# EAGLE design audio (EAGLE 6.4)
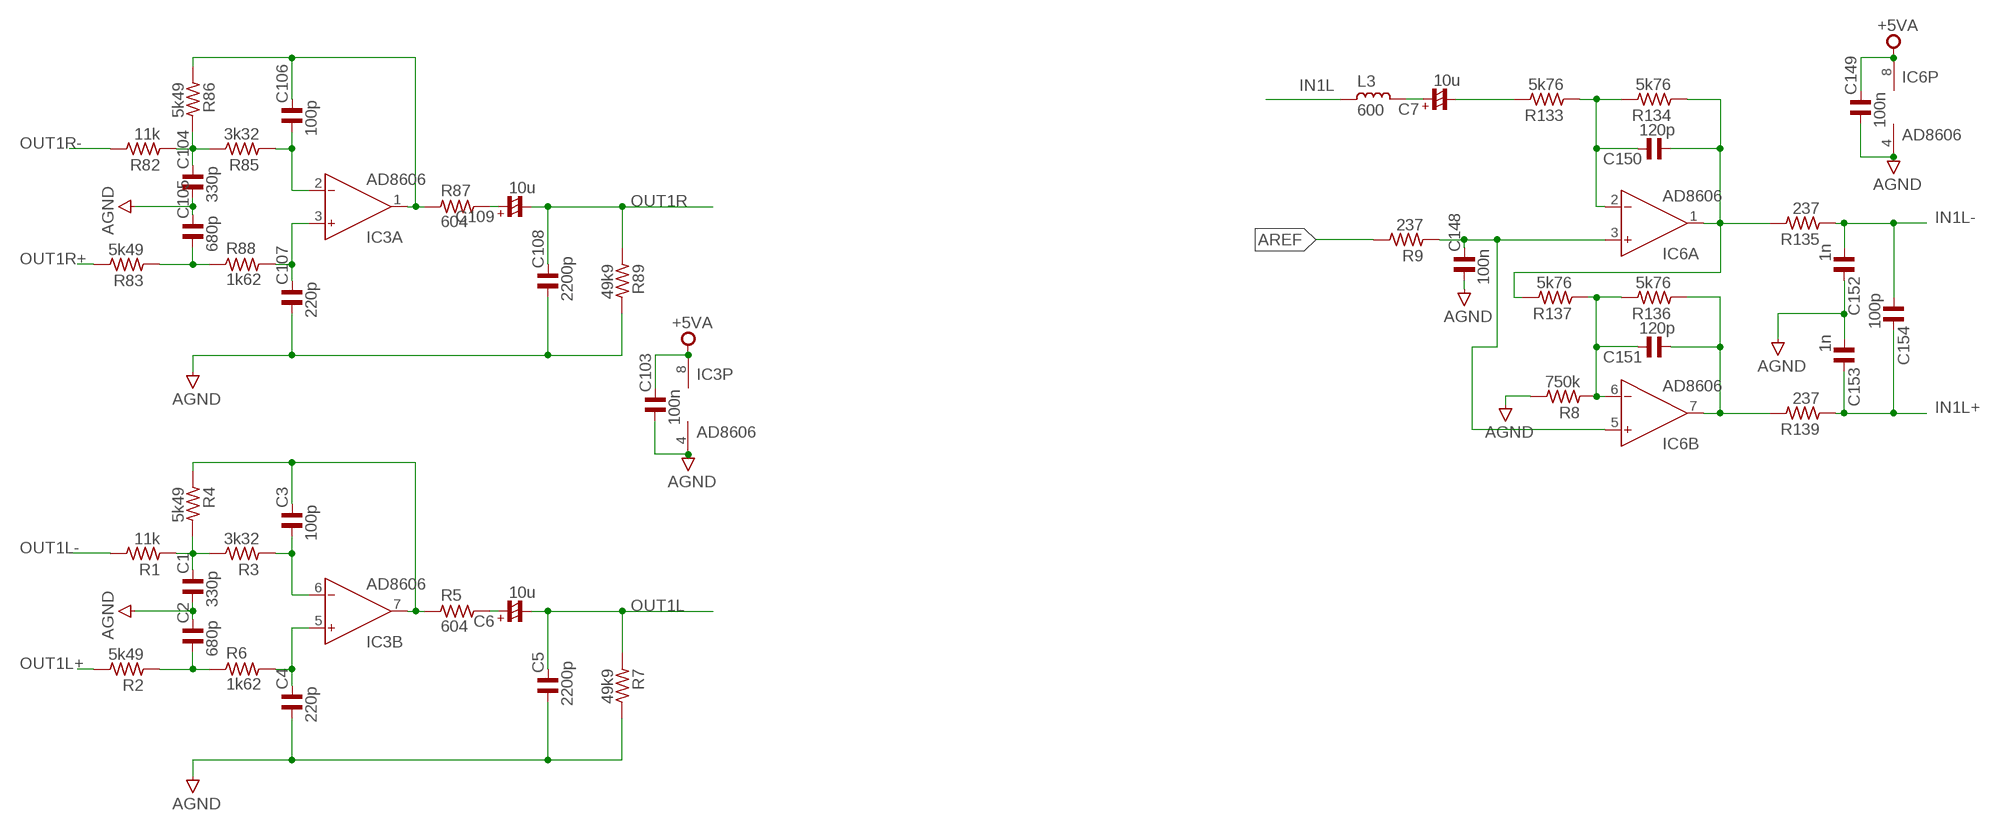
[diagram p0: schematic, sheet 1]

## Parts
C1  330p  C_0603  [C0603]
C2  680p  C_0603  [C0603]
C3  100p  C_0603  [C0603]
C4  220p  C_0603  [C0603]
C5  2200p  C_0603  [C0603]
C6  10u  CP_1206/T  [C1206/T]
C7  10u  CP_1206/T  [C1206/T]
C103  100n  C_0603  [C0603]
C104  330p  C_0603  [C0603]
C105  680p  C_0603  [C0603]
C106  100p  C_0603  [C0603]
C107  220p  C_0603  [C0603]
C108  2200p  C_0603  [C0603]
C109  10u  CP_1206/T  [C1206/T]
C148  100n  C_0603  [C0603]
C149  100n  C_0603  [C0603]
C150  120p  C_0603  [C0603]
C151  120p  C_0603  [C0603]
C152  1n  C_0603  [C0603]
C153  1n  C_0603  [C0603]
C154  100p  C_0603  [C0603]
IC3  AD8606  AD8607R  [SO8]
IC6  AD8606  AD8607R  [SO8]
L3  600  L_1206  [L1206]
R1  11k  R_0603  [R0603]
R2  5k49  R_0603  [R0603]
R3  3k32  R_0603  [R0603]
R4  5k49  R_0603  [R0603]
R5  604  R_0603  [R0603]
R6  1k62  R_0603  [R0603]
R7  49k9  R_0603  [R0603]
R8  750k  R_0603  [R0603]
R9  237  R_0603  [R0603]
R82  11k  R_0603  [R0603]
R83  5k49  R_0603  [R0603]
R85  3k32  R_0603  [R0603]
R86  5k49  R_0603  [R0603]
R87  604  R_0603  [R0603]
R88  1k62  R_0603  [R0603]
R89  49k9  R_0603  [R0603]
R133  5k76  R_0603  [R0603]
R134  5k76  R_0603  [R0603]
R135  237  R_0603  [R0603]
R136  5k76  R_0603  [R0603]
R137  5k76  R_0603  [R0603]
R139  237  R_0603  [R0603]

## Nets
+5VA: C103.2 C149.2 IC3.8(P:V+) IC6.8(P:V+)
AGND: C1.1 C2.2 C4.1 C5.1 C103.1 C104.1 C105.2 C107.1 C108.1 C148.1 C149.1 C152.2 C153.1 IC3.4(P:V-) IC6.4(P:V-) R7.2 R8.2 R89.2
AREF: R9.2
IN1L: L3.2
IN1L+: C153.2 C154.2 R139.1
IN1L-: C152.1 C154.1 R135.1
N$1: C1.2 R1.1 R3.2 R4.2
N$2: C2.1 R2.1 R6.1
N$3: C4.2 IC3.5(B:IN+) R6.2
N$4: C3.2 IC3.7(B:OUT) R4.1 R5.1
N$5: C6.+ R5.2
N$6: C3.1 IC3.6(B:IN-) R3.1
N$7: C7.+ L3.1
N$8: C7.- R133.2
N$10: C148.2 IC6.3(A:IN+) IC6.5(B:IN+) R9.1
N$68: C104.2 R82.1 R85.2 R86.2
N$69: C105.1 R83.1 R88.1
N$70: C107.2 IC3.3(A:IN+) R88.2
N$71: C106.2 IC3.1(A:OUT) R86.1 R87.1
N$72: C109.+ R87.2
N$74: C106.1 IC3.2(A:IN-) R85.1
N$104: C150.1 IC6.1(A:OUT) R134.1 R135.2 R137.2
N$105: C151.1 IC6.7(B:OUT) R136.1 R139.2
N$108: C150.2 IC6.2(A:IN-) R133.1 R134.2
N$110: C151.2 IC6.6(B:IN-) R8.1 R136.2 R137.1
OUT1L: C5.2 C6.- R7.1
OUT1L+: R2.2
OUT1L-: R1.2
OUT1R: C108.2 C109.- R89.1
OUT1R+: R83.2
OUT1R-: R82.2

## Library data of the parts
C1-C5 C103-C108 C148-C154 = rc-master-smd:C_: NON-POLARIZED CAP
C6 C7 C109 = rc-master-smd:CP_: POLARIZED CAP
IC3 IC6 = analog-devices:AD8607: Precision Micropower, Low Noise CMOS, Rail-to-Rail Input/Output Operational Amplifiers Source: http://www.analog.com/static/imported-files/data_sheets/AD8603_8607_8609.pdf; MPN: AD8607ARMZ-R2; OC_FARNELL: 1651293; OC_NEWARK: 19M8927
L3 = rc-master-smd:L_: INDUCTOR
R1-R9 R82 R83 R85-R89 R133-R137 R139 = rc-master-smd:R_: RESISTOR

## Board
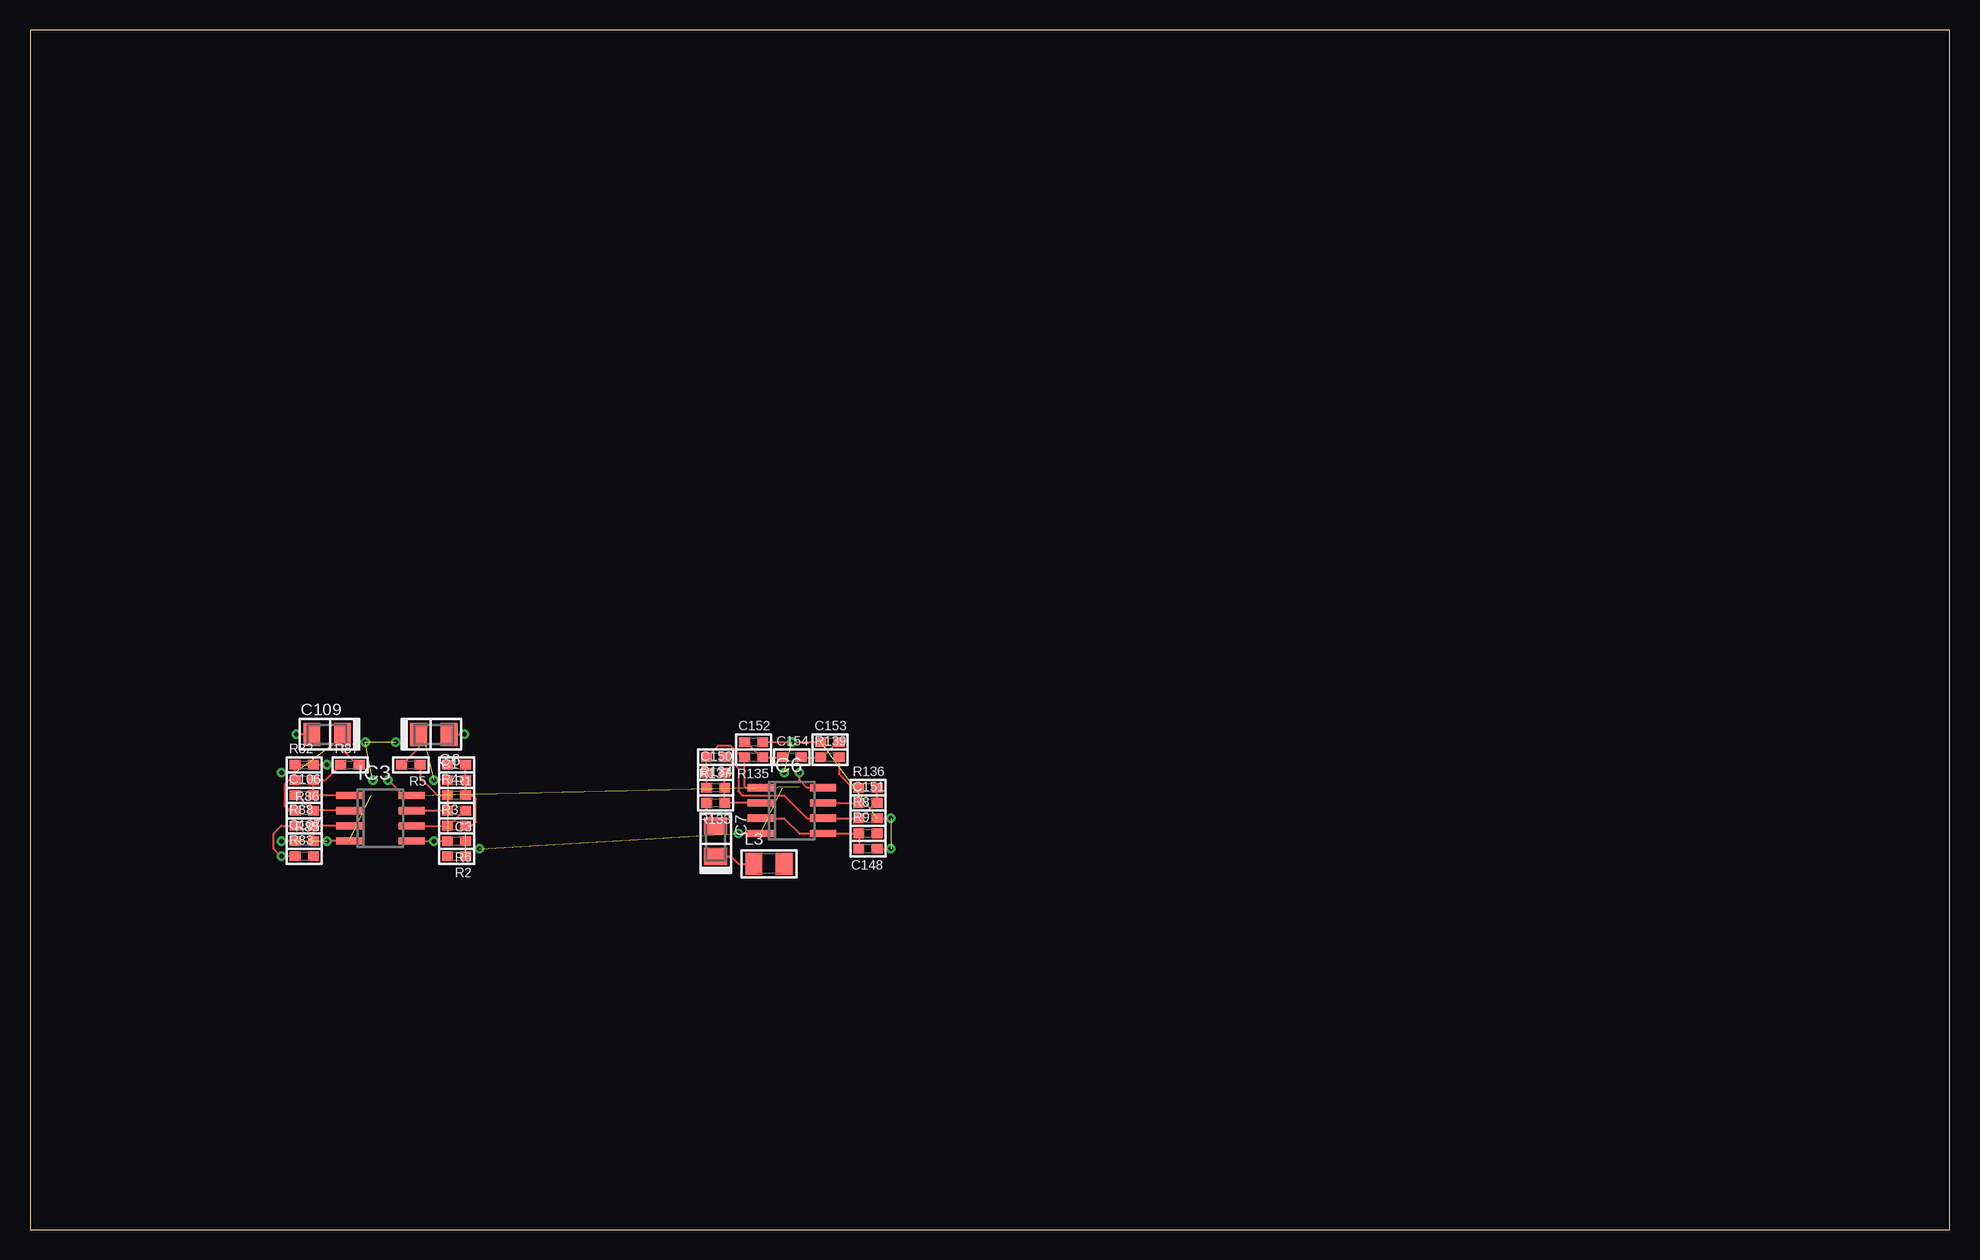
[diagram p1: board, top side]
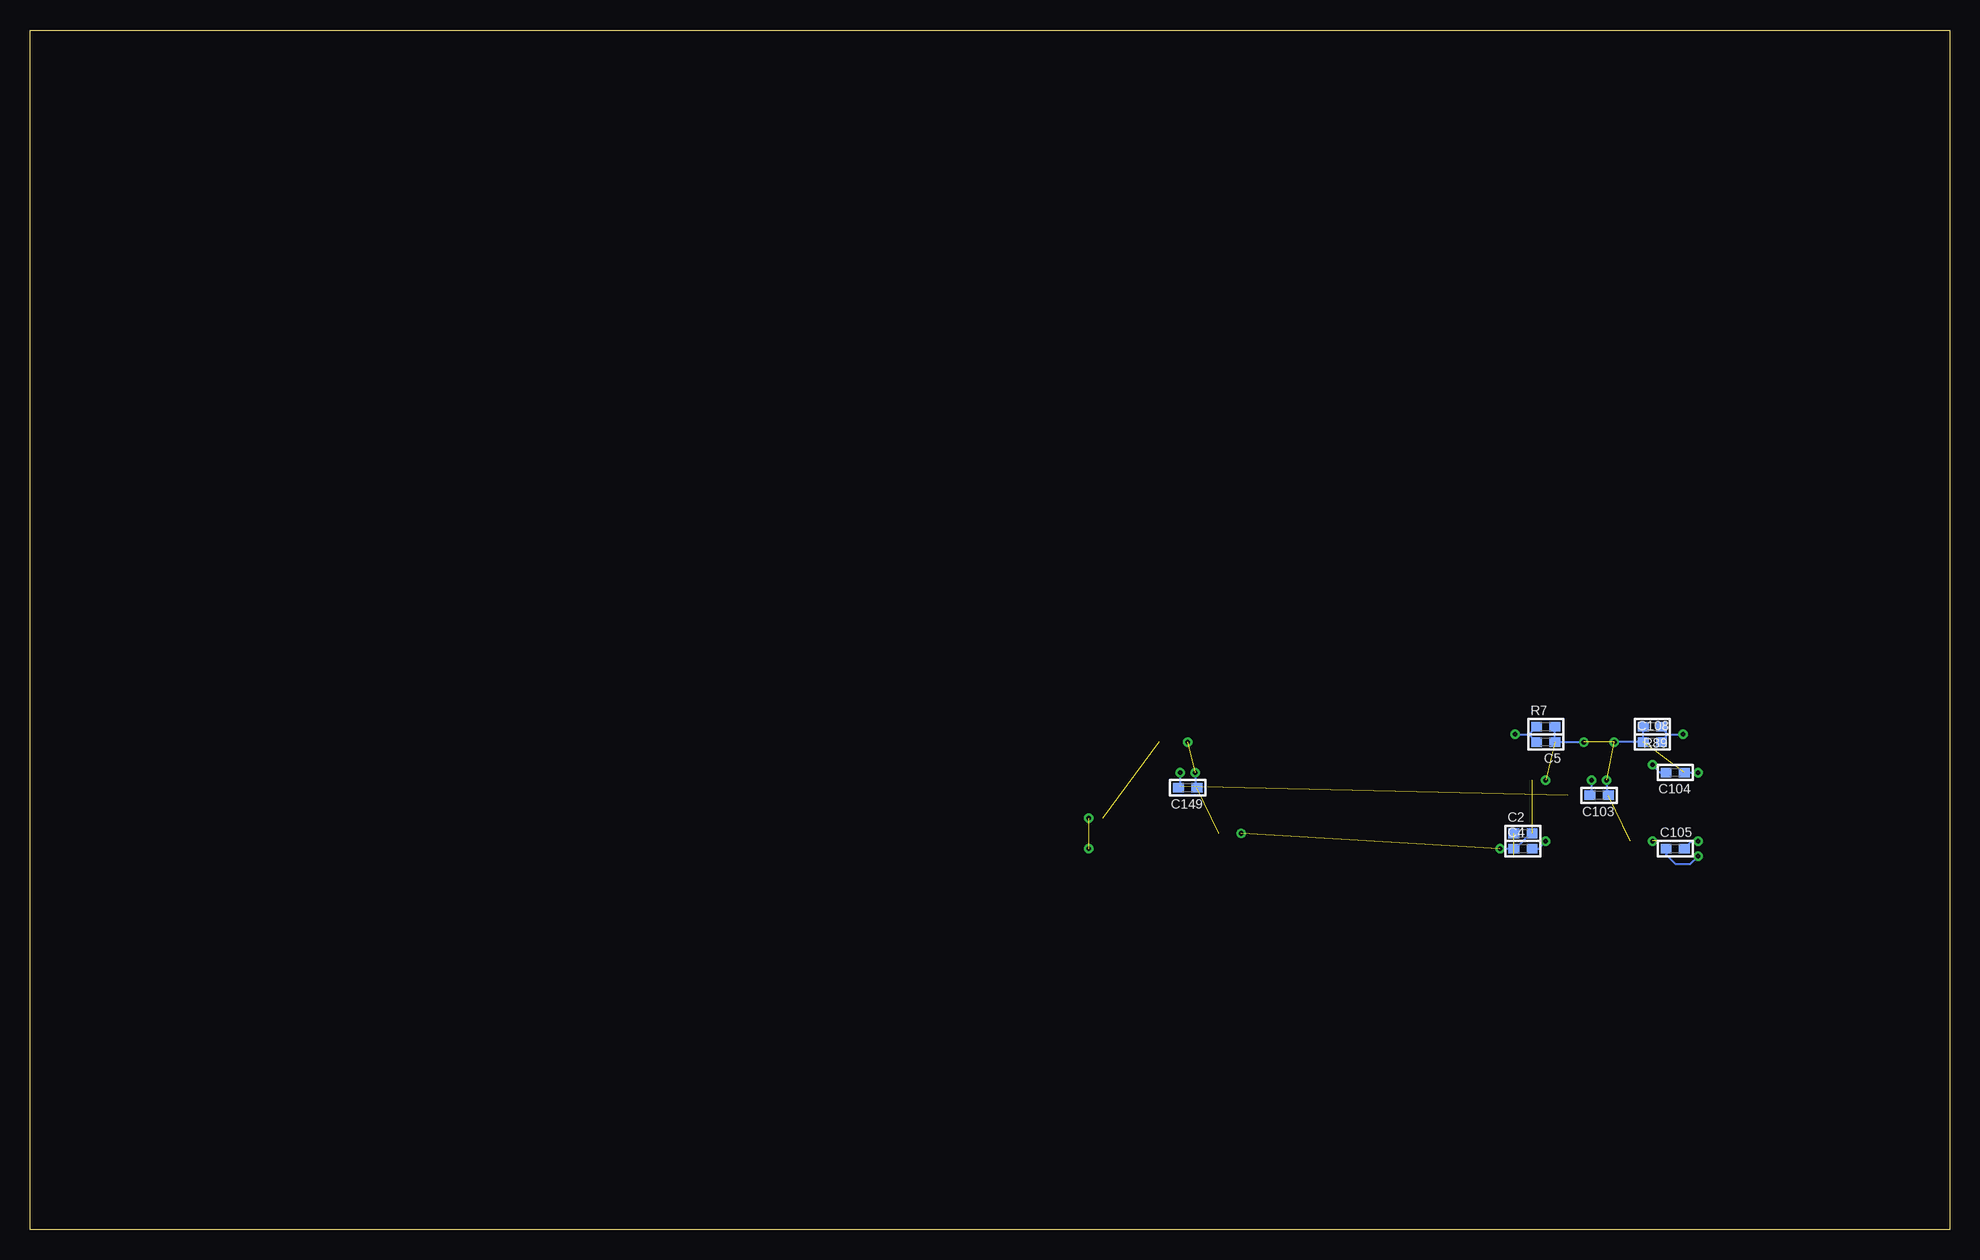
[diagram p2: board, bottom side, seen from below]

Size 160 x 100 mm. Coordinates in mm from the lower left corner, seen from the top.
Outline: 0,0 160,0 160,100 0,100 0,0
Copper layers (1*16): Top 0.035mm / dielectric 1.5mm / Bottom 0.035mm
Design rules "default": minimum track width 10mil, minimum drill 24mil, track to track 8mil, track to pad 8mil, pad to pad 8mil, via to via 8mil, smd to smd 8mil, copper to edge 40mil, drill to drill 8mil, minimum pad ring 10mil, minimum via ring 8mil, stop-mask expansion 4mil, vias tented up to drill 0mil, thermal gap 10mil

### Footprints (pad centres in the part's own frame; a part is rotated, then mirrored left to right if it is on the bottom)
C0603 = smd 0.9 x 0.8: 1 -0.762,0; 2 0.762,0
C1206/T = smd 1.4 x 1.9: + 1.27,0; - -1.27,0
SO8 = smd 0.6 x 2.2: 1 -1.905,-2.6; 2 -0.635,-2.6; 3 0.635,-2.6; 4 1.905,-2.6; 5 1.905,2.6; 6 0.635,2.6; 7 -0.635,2.6; 8 -1.905,2.6
L1206 = smd 1.4 x 1.8: 1 -1.27,0; 2 1.27,0
R0603 = smd 0.9 x 0.8: 1 -0.762,0; 2 0.762,0

### Placement (x,y rotation side)
C1  35.56,37.47 0 top
C2  35.56,33.02 0 bottom
C3  35.56,34.92 180 top
C4  35.56,31.75 0 bottom
C5  33.66,40.64 180 bottom
C6  33.66,41.27 180 top
C7  57.15,32.38 270 top
C103  29.21,36.2 180 bottom
C104  22.86,38.1 180 bottom
C105  22.86,31.75 0 bottom
C106  22.86,36.2 0 top
C107  22.86,32.38 0 top
C108  24.77,40.64 0 bottom
C109  24.77,41.27 0 top
C148  69.85,31.75 180 top
C149  63.5,36.83 180 bottom
C150  57.15,38.1 0 top
C151  69.85,35.56 0 top
C152  60.33,40.64 0 top
C153  66.67,40.64 0 top
C154  63.5,39.37 0 top
IC3  29.21,34.29 270 top
IC6  63.5,34.92 270 top
L3  61.59,30.48 0 top
R1  35.56,38.73 180 top
R2  35.56,31.11 180 top
R3  35.56,33.66 0 top
R4  35.56,36.2 0 top
R5  31.75,38.73 180 top
R6  35.56,32.38 180 top
R7  33.66,41.91 0 bottom
R8  69.85,34.29 0 top
R9  69.85,33.02 0 top
R82  22.86,38.73 0 top
R83  22.86,31.11 0 top
R85  22.86,34.92 180 top
R86  22.86,37.47 180 top
R87  26.67,38.73 0 top
R88  22.86,33.66 0 top
R89  24.77,41.91 180 bottom
R133  57.15,35.56 180 top
R134  57.15,36.83 0 top
R135  60.33,39.37 180 top
R136  69.85,36.83 0 top
R137  57.15,39.37 180 top
R139  66.67,39.37 0 top

### Tracks (layer width: path | path; a pad name or v marks a point on that pad's centre or on a via)
+5VA  (via drill 0.38)  (1 unrouted)
  Top 0.152: IC3.8 31.11,36.2 v29.84,37.47 | IC6.8 64.77,36.83 64.14,37.47 v64.14,38.1
  Bottom 0.152: v29.84,37.47 29.84,36.32 C103.2 | v64.14,38.1 64.14,36.96 C149.2
AGND  (via drill 0.38)  (12 unrouted)
  Top 0.152: IC3.4 v24.77,32.38 | C107.1 v20.95,32.38 | C1.1 v33.66,37.47 | IC6.4 v59.05,33.02 | C152.2 v63.5,40.64 C153.1 | C148.1 v71.75,31.75 | R8.2 v71.75,34.29
  Bottom 0.152: v20.95,32.38 21.46,32.38 C105.2 | C104.1 v20.95,38.1 | R89.2 C108.1 v27.94,40.64 | v28.57,37.47 28.57,36.32 C103.1 | R7.2 C5.1 v30.48,40.64 | C2.2 34.92,33.02 36.2,31.75 C4.1 v37.47,31.75 | v62.87,38.1 62.87,36.96 C149.1
IN1L+
  Top 0.152: C154.2 R139.1 66.04,39.37 67.31,40.64 C153.2
IN1L-
  Top 0.152: C154.1 R135.1 60.96,39.37 59.69,40.64 C152.1
N$1
  Top 0.152: R3.2 36.83,33.66 37.15,33.97 37.15,35.88 36.83,36.2 R4.2 C1.2 R1.1
N$2  (2 unrouted)
N$3  (via drill 0.38)
  Top 0.152: IC3.5 v33.66,32.38 R6.2
  Bottom 0.152: C4.2 34.29,31.75 v33.66,32.38
N$4
  Top 0.152: IC3.7 C3.2 R4.1 33.97,36.2 32.51,37.66 R5.1
N$5
  Top 0.152: C6.+ 32.38,40.13 R5.2
N$6
  Top 0.152: IC3.6 R3.1 34.92,33.66 36.2,34.92 C3.1
N$7
  Top 0.152: C7.+ 58.42,31.11 59.05,30.48 L3.1
N$8
  Top 0.152: R133.2 56.39,35.05 56.83,34.61 56.83,33.97 C7.-
N$10
  Top 0.152: IC6.3 62.87,34.29 64.14,33.02 IC6.5 R9.1 C148.2
N$68  (via drill 0.38)
  Top 0.152: R85.2 21.59,34.92 21.27,35.24 21.27,37.15 21.59,37.47 R86.2 R82.1 v24.77,38.73
  Bottom 0.152: C104.2 24.13,38.1 v24.77,38.73
N$69  (via drill 0.38)
  Top 0.152: R83.1 v20.95,31.11 20.32,31.75 20.32,33.02 20.95,33.66 R88.1
  Bottom 0.152: C105.1 23.62,31.24 22.86,30.48 21.59,30.48 v20.95,31.11
N$70
  Top 0.152: IC3.3 R88.2 C107.2
N$71
  Top 0.152: IC3.1 C106.2 R86.1 24.64,37.47 R87.1
N$72
  Top 0.152: R87.2 27.3,38.73 26.04,40.01 C109.+
N$74
  Top 0.152: IC3.2 R85.1 23.5,34.92 22.23,36.2 C106.1
N$104
  Top 0.152: IC6.1 59.69,36.83 59.56,36.96 R135.2 59.37,39.37 58.42,40.32 57.34,40.32 R137.2 C150.1 R134.1
N$105
  Top 0.152: IC6.7 C151.1 R136.1 68.58,36.83 67.44,37.97 R139.2
N$108
  Top 0.152: IC6.2 R133.1 R134.2 C150.2
N$110
  Top 0.152: R136.2 C151.2 70.48,35.56 69.22,34.29 R8.1 IC6.6 64.77,34.29 62.87,36.2 59.37,36.2 59.05,36.51 59.05,38.42 58.1,39.37 R137.1
OUT1L  (via drill 0.38)
  Top 0.152: C6.- v36.2,41.27
  Bottom 0.152: v36.2,41.27 C6.- | C6.- 34.92,41.4 R7.1 | C6.- 34.92,41.15 C5.2
OUT1R  (via drill 0.38)
  Top 0.152: C109.- v22.23,41.27
  Bottom 0.152: C108.2 24,40.77 C109.- | R89.1 24,41.78 C109.- | C109.- v22.23,41.27